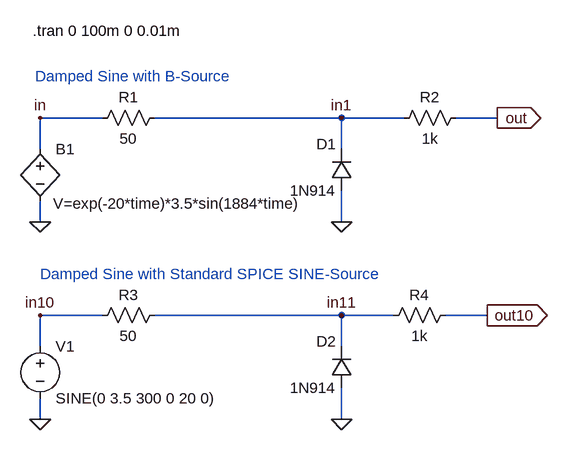
[diagram p0: schematic DampedSine.asc]
DampedSine.asc, the LTspice schematic file:
Version 4
SHEET 1 1232 680
WIRE 48 96 -48 96
WIRE -48 96 -48 144
WIRE 128 96 416 96
WIRE -48 224 -48 256
WIRE 416 144 416 96
WIRE 416 96 512 96
WIRE 416 208 416 256
WIRE 592 96 656 96
WIRE 48 400 -48 400
WIRE -48 400 -48 448
WIRE 128 400 416 400
WIRE -48 528 -48 560
WIRE 416 448 416 400
WIRE 416 400 496 400
WIRE 416 512 416 560
WIRE 576 400 640 400
FLAG -48 256 0
FLAG 416 256 0
FLAG 656 96 out
IOPIN 656 96 Out
FLAG -48 96 in
FLAG 416 96 in1
FLAG -48 560 0
FLAG 416 560 0
FLAG 640 400 out10
IOPIN 640 400 Out
FLAG -48 400 in10
FLAG 416 400 in11
SYMBOL bv -48 128 R0
WINDOW 3 20 100 Left 0
SYMATTR Value V=exp(-20*time)*3.5*sin(1884*time)
SYMATTR InstName B1
SYMBOL res 32 112 R270
WINDOW 0 32 56 VTop 0
WINDOW 3 0 56 VBottom 0
SYMATTR InstName R1
SYMATTR Value 50
SYMBOL diode 432 208 R180
WINDOW 0 24 72 Left 0
WINDOW 3 24 0 Left 0
SYMATTR InstName D1
SYMATTR Value 1N914
SYMBOL res 496 112 R270
WINDOW 0 32 56 VTop 0
WINDOW 3 0 56 VBottom 0
SYMATTR InstName R2
SYMATTR Value 1k
SYMBOL res 32 416 R270
WINDOW 0 32 56 VTop 0
WINDOW 3 0 56 VBottom 0
SYMATTR InstName R3
SYMATTR Value 50
SYMBOL diode 432 512 R180
WINDOW 0 24 72 Left 0
WINDOW 3 24 0 Left 0
SYMATTR InstName D2
SYMATTR Value 1N914
SYMBOL res 480 416 R270
WINDOW 0 32 56 VTop 0
WINDOW 3 0 56 VBottom 0
SYMATTR InstName R4
SYMATTR Value 1k
SYMBOL voltage -48 432 R0
WINDOW 123 0 0 Left 0
WINDOW 39 0 0 Left 0
SYMATTR InstName V1
SYMATTR Value SINE(0 3.5 300 0 20 0)
TEXT -60 -38 Left 0 !.tran 0 100m 0 0.01m
TEXT -56 32 Left 0 ;Damped Sine with B-Source
TEXT -48 336 Left 0 ;Damped Sine with Standard SPICE SINE-Source

The netlist it stands for:
* DampedSine.asc
B1 in 0 V=exp(-20*time)*3.5*sin(1884*time)
R1 in in1 50
D1 0 in1 1N914
R2 in1 out 1k
R3 in10 in11 50
D2 0 in11 1N914
R4 in11 out10 1k
V1 in10 0 SINE(0 3.5 300 0 20 0)
.model D D
.lib standard.dio
.tran 0 100m 0 0.01m
* Damped Sine with B-Source
* Damped Sine with Standard SPICE SINE-Source
.backanno
.end